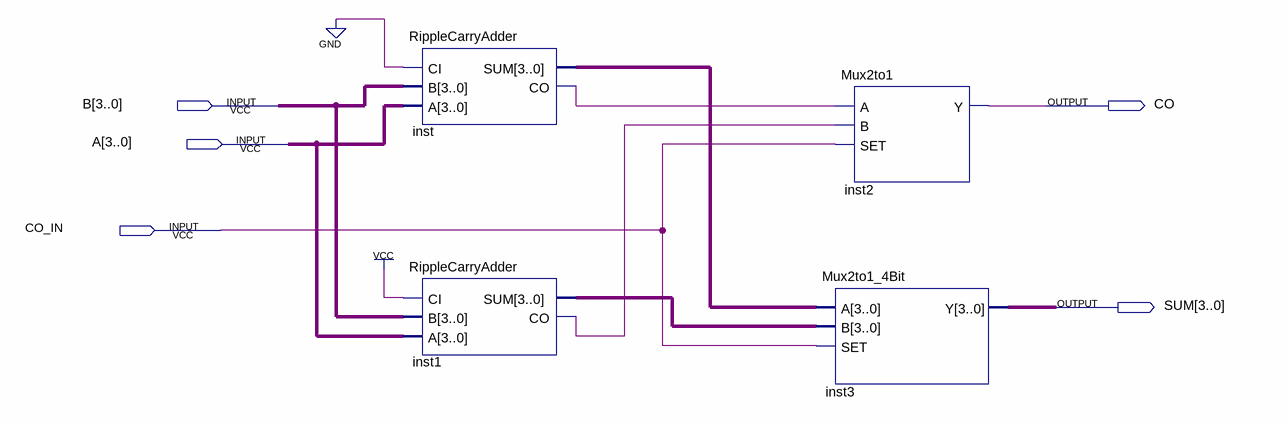
[diagram p0: schematic sheet]
// Quartus schematic CSA4.bdf as structural Verilog: 4 symbols, 5 pins
module CSA4 (
  input  [3:0] B,
  input  [3:0] A,
  input  CO_IN,
  output CO,
  output [3:0] SUM
);

  wire inst1_co, inst_co;
  wire [3:0] inst1_sum, inst_sum;

  RippleCarryAdder inst (.CI(1'b0), .B(B), .A(A), .SUM(inst_sum), .CO(inst_co));
  RippleCarryAdder inst1 (.CI(1'b1), .B(B), .A(A), .SUM(inst1_sum), .CO(inst1_co));
  Mux2to1 inst2 (.A(inst_co), .B(inst1_co), .SET(CO_IN), .Y(CO));
  Mux2to1_4Bit inst3 (.A(inst_sum), .B(inst1_sum), .SET(CO_IN), .Y(SUM));
endmodule
